# Altium schematic sheet I2C.SchDoc
size A4
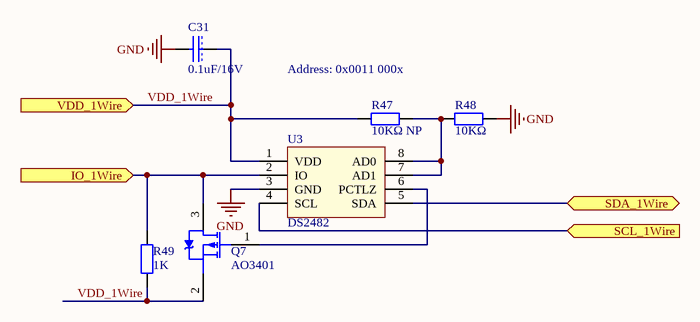
[diagram p0: I2C.SchDoc]

## Parts
C31  0.1uF/16V  [0603R]  (no BOM)
Q7  AO3401  [SOT-23]
R47  10KΩ NP  [0603R]
R48  10KΩ  [0603R]
R49  1K  [0603R]
U3  DS2482  [SO-8]

## Ports
IO_1Wire (in), SCL_1Wire (in), SDA_1Wire (bidir), VDD_1Wire (in)

## Nets
GND: C31.2 R48.1 U3.3(GND)
IO_1Wire: Q7.3(D) R49.2 U3.2(IO) ; port IO_1Wire
SCL_1Wire: U3.4(SCL) ; port SCL_1Wire
SDA_1Wire: U3.5(SDA) ; port SDA_1Wire
VDD_1Wire: C31.1 Q7.2(S) R47.2 R49.1 U3.1(VDD) ; port VDD_1Wire
NetQ7_1: Q7.1(G) U3.6(PCTLZ)
NetR47_1: R47.1 R48.2 U3.7(AD1) U3.8(AD0)

## Notes on the sheet
- Address: 0x0011 000x
- Drawing Name
- 图纸名称
- Drawing
- 制图
- Auditing
- 审核
- EnvMonitor
- Confirming
- 批准
- Version
- 版本号
- 小甘工作室
- V1.00
- 日期
- Date
- Jack
- XiaoGan Studio

## Library data of the parts
C31 = CAP: 贴片陶瓷电容; Kind: 贴片陶瓷电容; Author: 叶建峰
Q7 = DMP3098L: -30V,-3.8A   PMOS  70-120mΩ; Manufacturer: DIODES; Kind: 贴片MOS管; Remark: 关键元器件
R47-R49 = RES_0603: OEMs: *; Type: 10KΩ; Package: 0603